# EAGLE board NFluidEX_v1 (EAGLE 9.6.2)
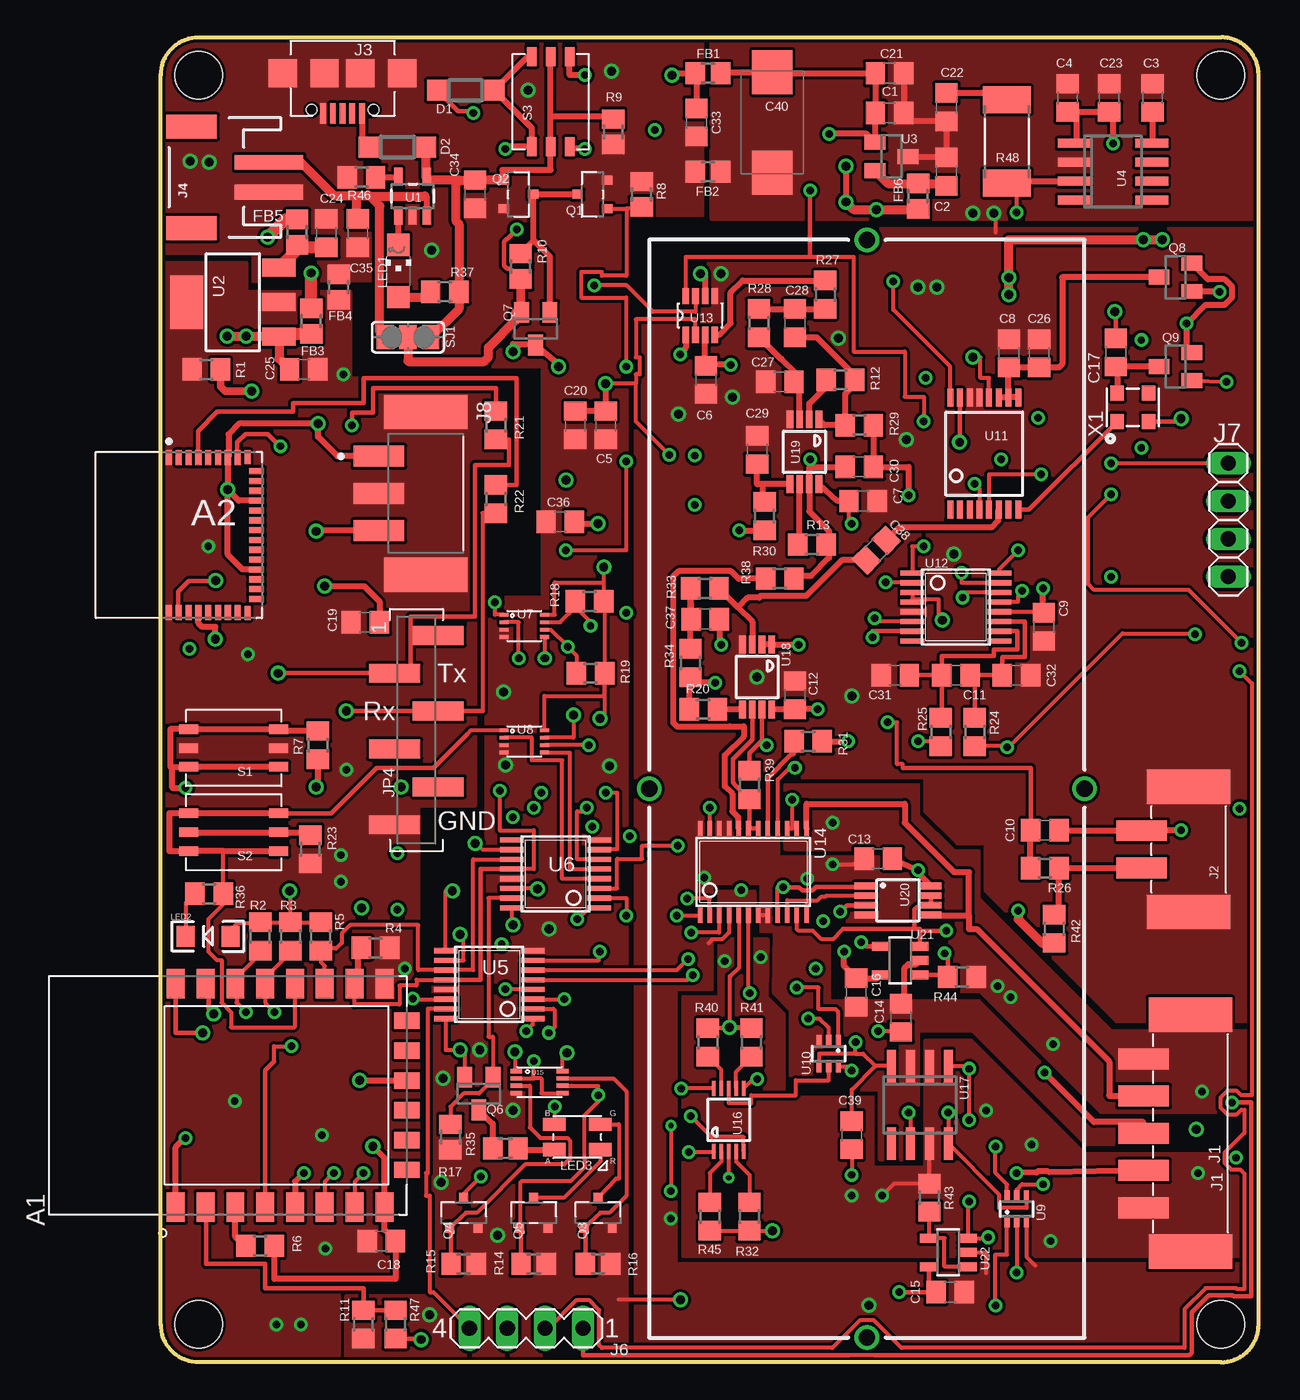
[diagram p2: board, top side]
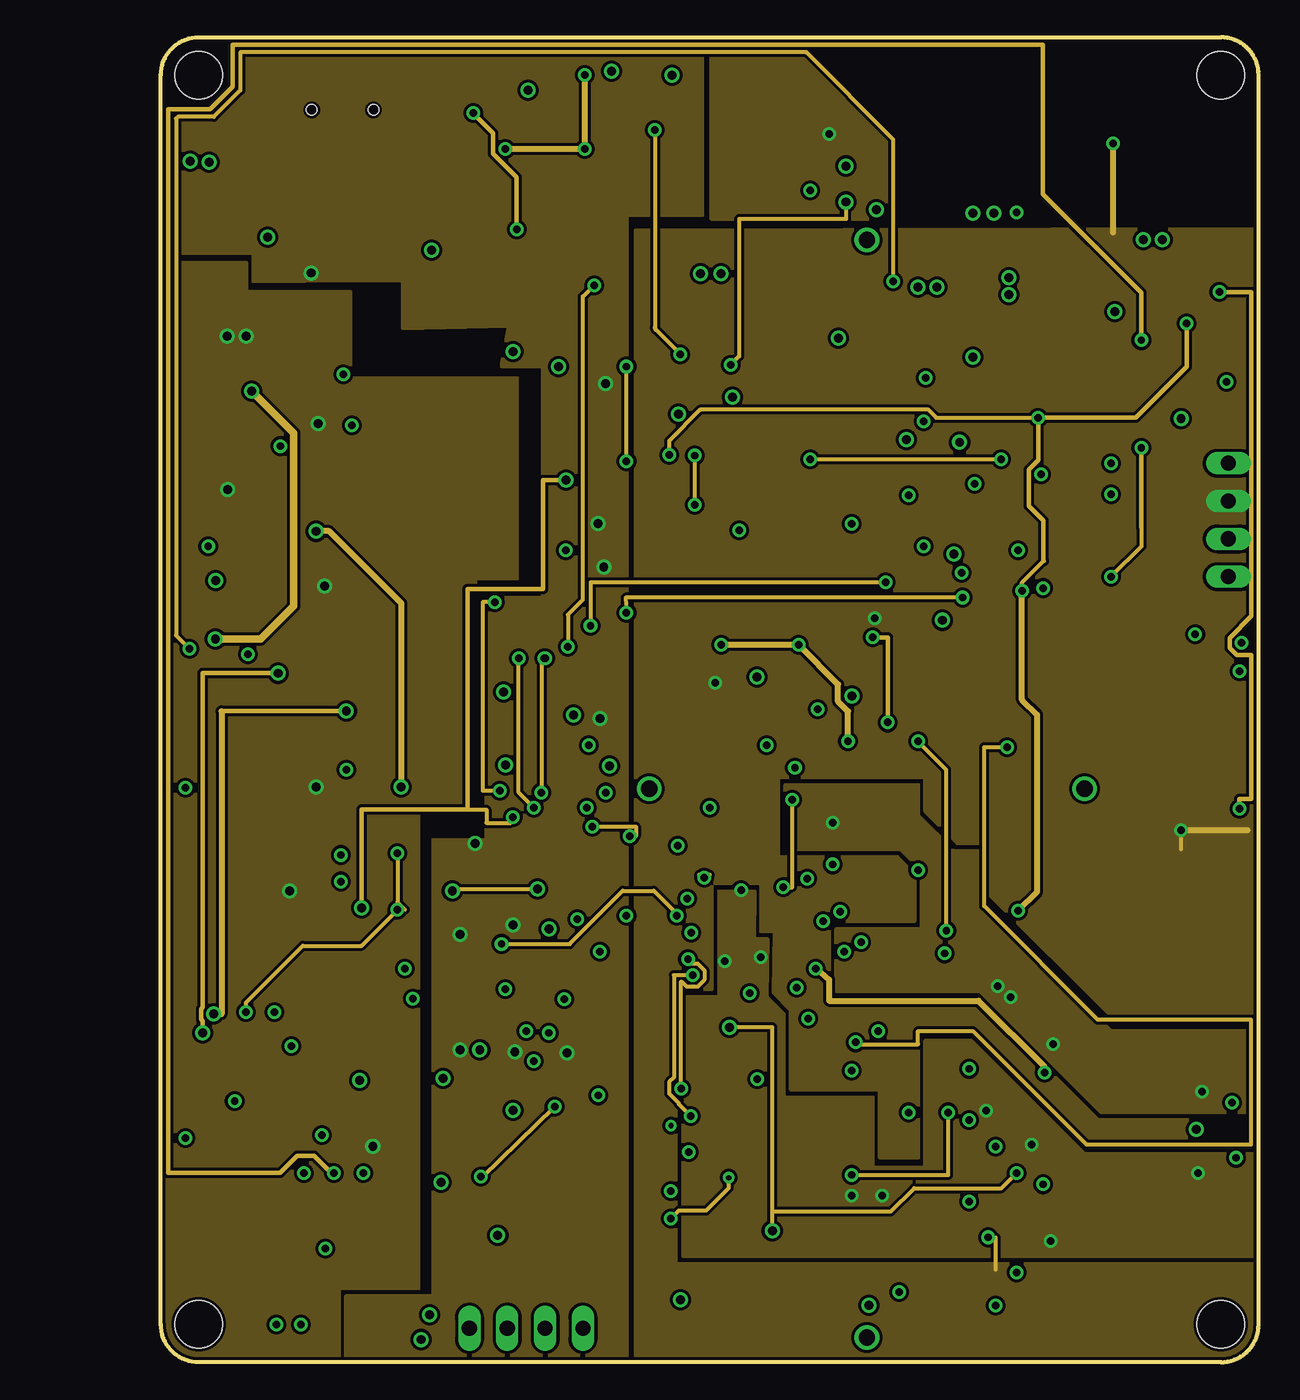
[diagram p3: board, inner layer Route2]
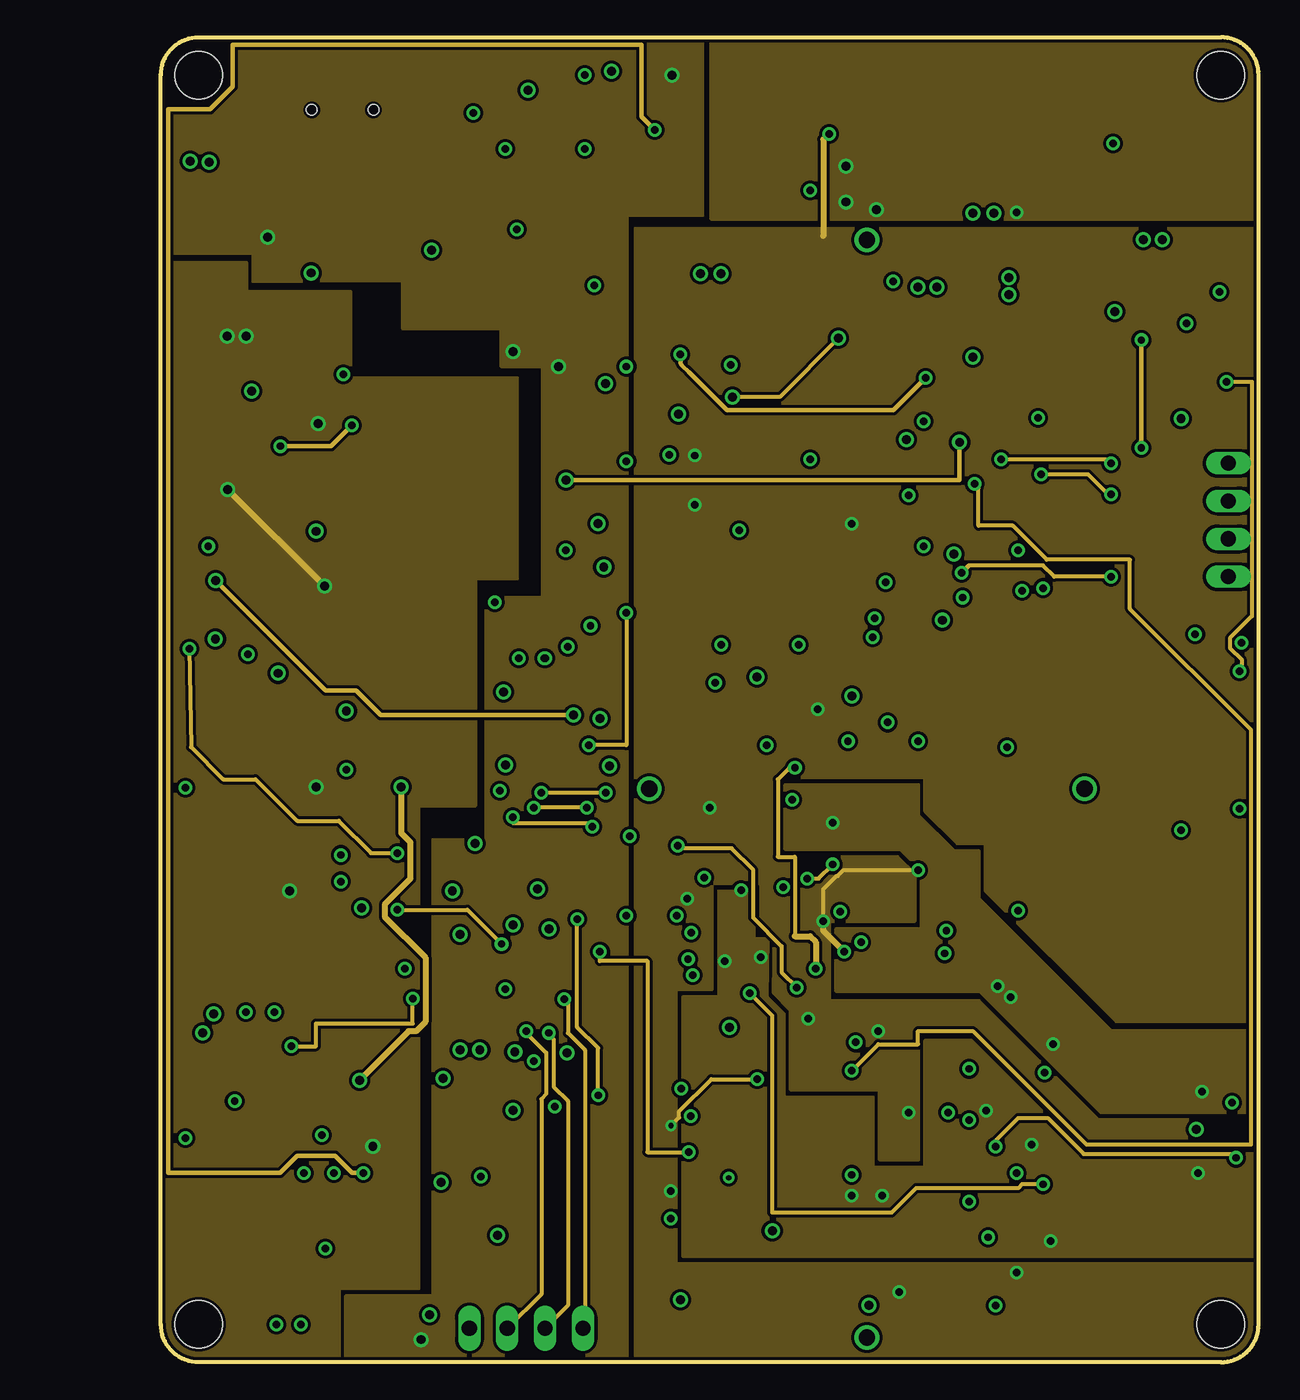
[diagram p4: board, inner layer Route15]
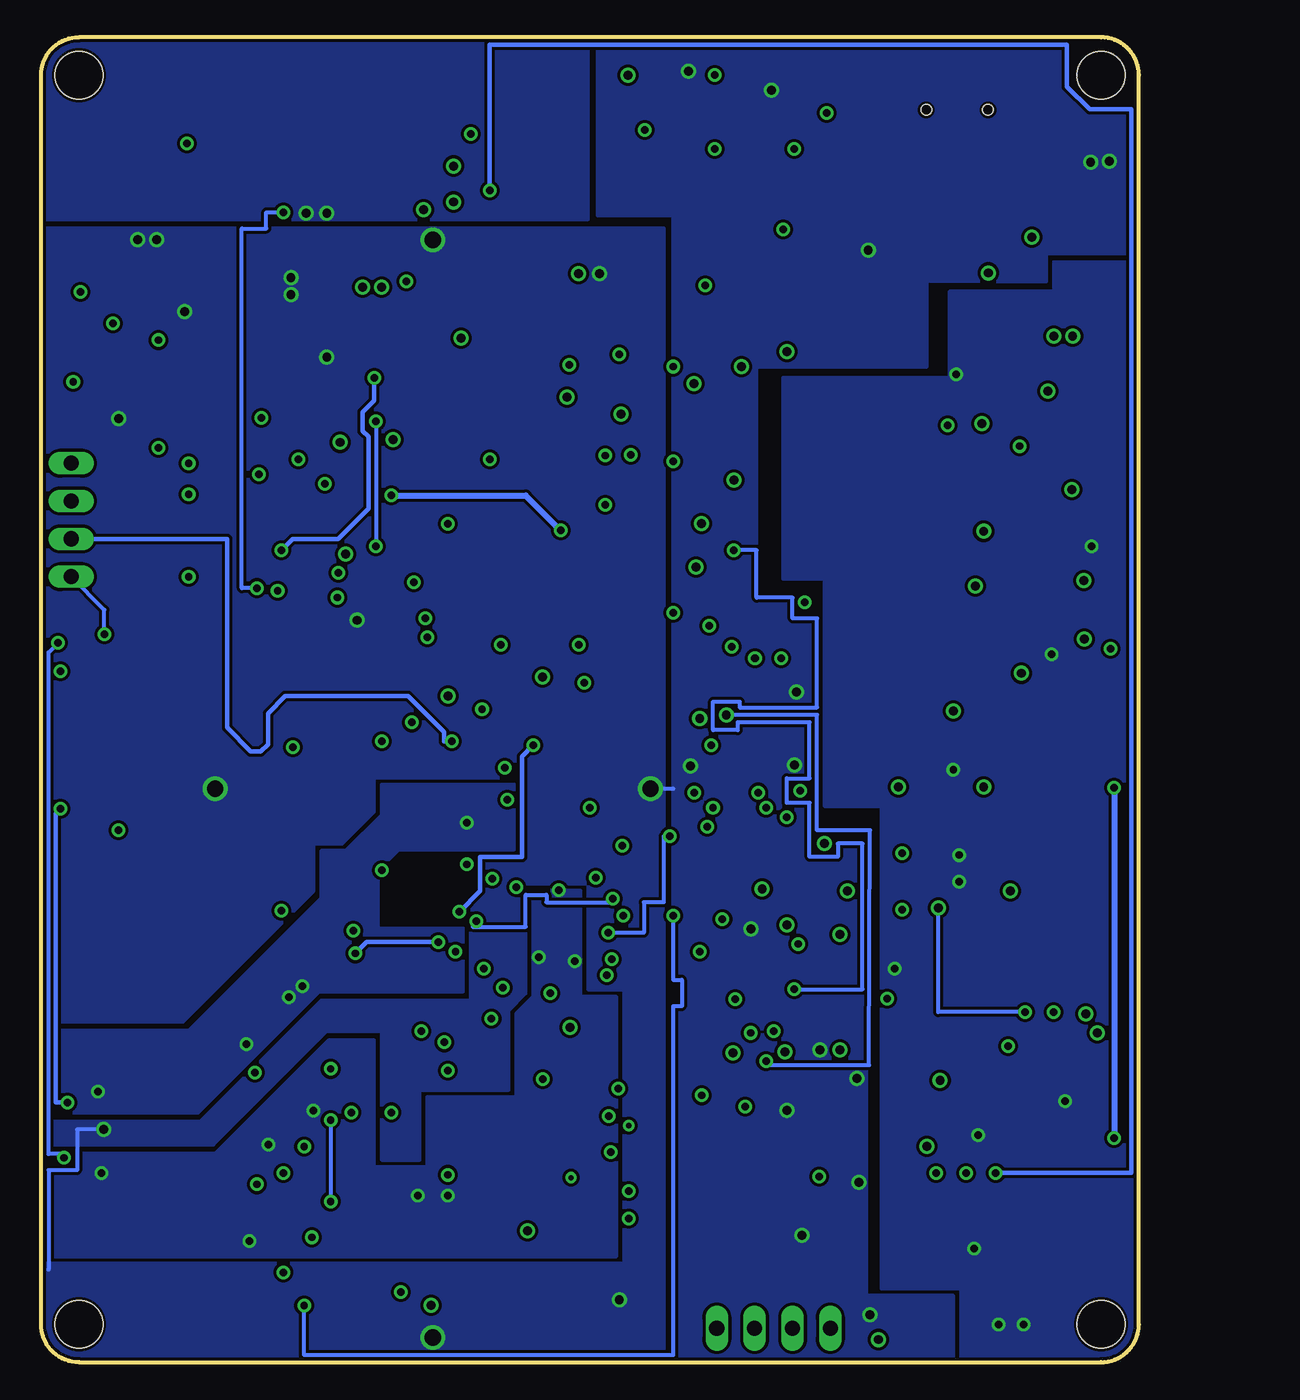
[diagram p5: board, bottom side, seen from below]

Size 73.66 x 88.9 mm. Coordinates in mm from the lower left corner, seen from the top.
Outline: 2.54,0 arc-90 0,2.54 0,86.36 arc-90 2.54,88.9 71.12,88.9 arc-90 73.66,86.36 73.66,2.54 arc-90 71.12,0 2.54,0
Copper layers (1+2*15+16): Top 0.035mm / dielectric 1.5mm / Route2 0.035mm / dielectric 0.15mm / Route15 0.035mm / dielectric 0.2mm / Bottom 0.035mm
Design rules "default *": minimum track width 10mil, minimum drill 12mil, track to track 8mil, track to pad 8mil, pad to pad 8mil, via to via 8mil, smd to smd 8mil, copper to edge 8mil, drill to drill 8mil, minimum pad ring 10mil, minimum via ring 8mil, stop-mask expansion 0mil, vias tented up to drill 0mil, thermal gap 10mil
Net classes: 1 VCC: width 0.381 mm; 2 LEDPower: width 0.203 mm; 3 ButtonSignal: width 0.203 mm
Holes 3.2 mm at 2.54,2.54 71.12,2.54 71.12,86.36 2.54,86.36

## Footprints (pad centres in the part's own frame; a part is rotated, then mirrored left to right if it is on the bottom)
XCVR_ESP8266-12E/ESP-12E = smd 2 x 1.2: 1 -7.5,7; 2 -7.5,5; 3 -7.5,3; 4 -7.5,1; 5 -7.5,-1; 6 -7.5,-3; 7 -7.5,-5; 8 -7.5,-7; 15 7.5,-7; 16 7.5,-5; 17 7.5,-3; 18 7.5,-1; 19 7.5,1; 20 7.5,3; 21 7.5,5; 22 7.5,7 | smd 1.1 x 1.7: 9 -5,-8.5; 10 -3,-8.5; 11 -1,-8.5; 12 1,-8.5; 13 3,-8.5; 14 5,-8.5
CYPRESS_SEMICONDUCTOR_CYBLE-014008-00_0 = smd 0.99 x 0.41: 1 5.205,0.67; 2 5.205,0.01; 3 5.205,-0.65; 4 5.205,-1.31; 5 5.205,-1.97; 6 5.205,-2.63; 7 5.205,-3.29; 8 5.205,-3.95; 25 -5.205,-3.95; 26 -5.205,-3.29; 27 -5.205,-2.63; 28 -5.205,-1.97; 29 -5.205,-1.31; 30 -5.205,-0.65; 31 -5.205,0.01; 32 -5.205,0.67 | smd 0.94 x 0.41: 9 5.23,-4.61; 24 -5.23,-4.61 | smd 0.41 x 0.99: 10 4.29,-5.205; 11 3.63,-5.205; 12 2.97,-5.205; 13 2.31,-5.205; 14 1.65,-5.205; 15 0.99,-5.205; 16 0.33,-5.205; 17 -0.33,-5.205; 18 -0.99,-5.205; 19 -1.65,-5.205; 20 -2.31,-5.205; 21 -2.97,-5.205; 22 -3.63,-5.205; 23 -4.29,-5.205
C0805 = smd 1.3 x 1.5: 1 -0.95,0; 2 0.95,0
D/7343-31W = smd 2.95 x 2.7: + 3.375,0; - -3.375,0
DIODE_SOD123 = smd 1.4 x 1.4: A 1.9,0; C -1.9,0
R0805 = smd 1.3 x 1.5: 1 -0.85,0; 2 0.85,0
5-PIN-VERT_PHOENIX_SMD = smd 1.4 x 3.4: 1 -5,3.15; 2 -2.5,3.15; 3 0,3.15; 4 2.5,3.15; 5 5,3.15 | smd 2.3 x 5.6: ANCHOR@1 -7.95,0; ANCHOR@2 7.95,0
2-PIN-VERT_PHOENIX_SMD = smd 1.4 x 3.4: 1 -1.25,3.15; 2 1.25,3.15 | smd 2.3 x 5.6: ANCHOR@1 -4.2,0; ANCHOR@2 4.2,0
USB_MICRO_B_WURTH_629105136821 = smd 0.4 x 1.35: 1-PWR -1.3,2.7; 2-D- -0.65,2.7; 3-D+ 0,2.7; 4-ID 0.65,2.7; 5-GND 1.3,2.7 | smd 1.9 x 1.9: CASE1 -4,0; CASE2 -1.2,0; CASE3 1.2,0; CASE4 4,0 | hole 0.7: -2.075,2.45; 2.075,2.45
JST-2-SMD = smd 1 x 4.6: 1 -1,-3.7; 2 1,-3.7 | smd 1.6 x 3.4: NC1 -3.4,1.5; NC2 3.4,1.5
TSM-106-XX-XXX-SV = smd 1.27 x 3.429: 1 6.35,-1.46; 2 3.81,1.46; 3 1.27,-1.46; 4 -1.27,1.46; 5 -3.81,-1.46; 6 -6.35,1.46
MA04-1 = drill 1.016 long: 1 -3.81,0; 2 -1.27,0; 3 1.27,0; 4 3.81,0
1X04 = drill 1.016 long: 1 -3.81,0; 2 -1.27,0; 3 1.27,0; 4 3.81,0
PHOENIX_CONTACT_1771101_0 = smd 1.4 x 3.4: 1 -2.5,-3.15; 2 0,-3.15; 3 2.5,-3.15 | smd 2.3 x 5.6: 4 -5.45,0; 5 5.45,0
CHIPLED_1206 = smd 1.5 x 1.5: A 0,-1.75; C 0,1.75
LED-1206 = smd 1.2 x 1.4: A -1.5,0; C 1.5,0
LED_RGB_WURTH_150141M173100 = smd 1.5 x 0.9: A 1.55,0.85; B 1.55,-0.85; G -1.55,-0.85; R -1.55,0.85
NEXPERIA_BSS138P_215_0 = smd 0.7 x 0.6: 1 -1,0.95; 2 -1,-0.95; 3 1,0
SOT-23-3 = smd 1.4 x 1: 1 -1.1,0.95; 2 -1.1,-0.95; 3 1.1,0
R0805' = smd 1.3 x 1.5: 1 -0.95,0; 2 0.95,0
R2512 = smd 1.8 x 3.2: 1 -2.8,0; 2 2.8,0
RAFI-MICON5_SWITCH = smd 1.27 x 0.635: A1 -3.025,1.27; A2 3.025,1.27; A3 -3.025,-1.27; A4 3.025,-1.27; K1 -3.025,0; K2 3.025,0
SMARTDART-SHIELD = drill 1.1: P$1 -36.83,0; P$2 36.83,0; P$3 0,14.605; P$4 0,-14.605
SJ_2 = smd 1.168 x 1.6: 1 -1.524,0; 2 0,0; 3 1.524,0
SOT23-5 = smd 0.55 x 1.2: 1 -0.95,-1.3; 2 0,-1.3; 3 0.95,-1.3; 4 0.95,1.3; 5 -0.95,1.3
SOT-223 = smd 1.219 x 2.235: 1 -2.311,-3.099; 2 0,-3.099; 3 2.311,-3.099 | smd 3.6 x 2.2: 4 0,3.099
SOIC-8 = smd 2.2 x 0.6: 1 -2.6,1.905; 2 -2.6,0.635; 3 -2.6,-0.635; 4 -2.6,-1.905; 5 2.6,-1.905; 6 2.6,-0.635; 7 2.6,0.635; 8 2.6,1.905
TSSOP16 = smd 1.6 x 0.35: 1 -2.918,2.275; 2 -2.918,1.625; 3 -2.918,0.975; 4 -2.918,0.325; 5 -2.918,-0.325; 6 -2.918,-0.975; 7 -2.918,-1.625; 8 -2.918,-2.275; 9 2.918,-2.275; 10 2.918,-1.625; 11 2.918,-0.975; 12 2.918,-0.325; 13 2.918,0.325; 14 2.918,0.975; 15 2.918,1.625; 16 2.918,2.275
VSSOP8 = smd 0.6 x 0.25: 1 -1.35,0.75; 2 -1.35,0.25; 3 -1.35,-0.25; 4 -1.35,-0.75; 5 1.35,-0.75; 6 1.35,-0.25; 7 1.35,0.25; 8 1.35,0.75
SC70-6 = smd 0.35 x 0.8: 1 -0.63,-0.85; 2 0.02,-0.85; 3 0.67,-0.85; 4 0.67,0.85; 5 0.02,0.85; 6 -0.63,0.85
SSOP-16 = smd 1.2 x 0.4: 1 -3.751,2.275; 2 -3.751,1.625; 3 -3.751,0.975; 4 -3.751,0.325; 5 -3.751,-0.325; 6 -3.751,-0.975; 7 -3.751,-1.625; 8 -3.751,-2.275; 9 3.751,-2.275; 10 3.751,-1.625; 11 3.751,-0.975; 12 3.751,-0.325; 13 3.751,0.325; 14 3.751,0.975; 15 3.751,1.625; 16 3.751,2.275
SOT-23-8 = smd 1.1 x 0.45: 1 -1.3,0.975; 2 -1.3,0.325; 3 -1.3,-0.325; 4 -1.3,-0.975; 5 1.3,-0.975; 6 1.3,-0.325; 7 1.3,0.325; 8 1.3,0.975
TSSOP24 = smd 0.991 x 0.305: 1 -2.918,3.575; 2 -2.918,2.925; 3 -2.918,2.275; 4 -2.918,1.625; 5 -2.918,0.975; 6 -2.918,0.325; 7 -2.918,-0.325; 8 -2.918,-0.975; 9 -2.918,-1.625; 10 -2.918,-2.275; 11 -2.918,-2.925; 12 -2.918,-3.575; 13 2.918,-3.575; 14 2.918,-2.925; 15 2.918,-2.275; 16 2.918,-1.625; 17 2.918,-0.975; 18 2.918,-0.325; 19 2.918,0.325; 20 2.918,0.975; 21 2.918,1.625; 22 2.918,2.275; 23 2.918,2.925; 24 2.918,3.575
US-8 = smd 0.8 x 0.3: 1 -1.55,0.75; 2 -1.55,0.25; 3 -1.55,-0.25; 4 -1.55,-0.75; 5 1.55,-0.75; 6 1.55,-0.25; 7 1.55,0.25; 8 1.55,0.75
MSOP10 = smd 1 x 0.25: 1 -2.113,1; 2 -2.113,0.5; 3 -2.113,0; 4 -2.113,-0.5; 5 -2.113,-1; 6 2.113,-1; 7 2.113,-0.5; 8 2.113,0; 9 2.113,0.5; 10 2.113,1
UMAX8 = smd 1.2 x 0.45: 1 -2.175,0.975; 2 -2.175,0.325; 3 -2.175,-0.325; 4 -2.175,-0.975; 5 2.175,-0.975; 6 2.175,-0.325; 7 2.175,0.325; 8 2.175,0.975
MSOP8 = smd 1.45 x 0.45: 1 -2.2,0.975; 2 -2.2,0.325; 3 -2.2,-0.325; 4 -2.2,-0.975; 5 2.2,-0.975; 6 2.2,-0.325; 7 2.2,0.325; 8 2.2,0.975
SOT23-5' = smd 0.6 x 1.2: 1 -0.95,-1.306; 2 0,-1.306; 3 0.95,-1.306; 4 0.95,1.306; 5 -0.95,1.306
DSC60XX_OSCILLATOR_3.2X2.5MM = smd 1 x 0.9: 1 -0.95,1.05; 2 -0.95,-1.05; 3 0.95,-1.05; 4 0.95,1.05

## Placement (x,y rotation side)
A1  ESP8266-12E/ESP-12E  [XCVR_ESP8266-12E/ESP-12E]  8,17.91 90 top
A2  CYPRESS_SEMICONDUCTOR_CYBLE-014008-00CYPRESS_SEMICONDUCTOR_CYBLE-014008-00_0_0  [CYPRESS_SEMICONDUCTOR_CYBLE-014008-00_0]  1.21,55.5 90 top
C1  0.1uF  [C0805]  48.9,83.82 0 top
C2  0.1uF  [C0805]  52.7,79.88 90 top
C3  0.1uF  [C0805]  66.55,84.84 90 top
C4  0.1uF  [C0805]  60.83,84.84 90 top
C5  0.1uF  [C0805]  29.84,62.87 270 top
C6  0.1uF  [C0805]  36.58,65.91 270 top
C7  0.1uF  [C0805]  47.12,57.78 0 top
C8  0.1uF  [C0805]  56.9,67.69 90 top
C9  0.1uF  [C0805]  59.25,49.34 270 top
C10  0.1uF  [C0805]  59.31,35.69 0 top
C11  0.1uF  [C0805]  53.34,46.1 180 top
C12  0.1uF  [C0805]  42.55,44.75 90 top
C13  0.1uF  [C0805]  48.13,33.78 180 top
C14  0.1uF  [C0805]  49.66,23.11 90 top
C15  0.1uF  [C0805]  52.96,4.7 0 top
C16  0.1uF  [C0805]  46.66,24.82 270 top
C17  0.1uF  [C0805]  64.07,67.75 90 top
C18  10u  [C0805]  14.8,8.13 180 top
C19  10u  [C0805]  13.72,49.66 180 top
C20  10u  [C0805]  27.81,62.87 270 top
C21  10u  [C0805]  48.9,86.49 0 top
C22  10u  [C0805]  52.7,84.2 270 top
C23  10u  [C0805]  63.63,84.84 90 top
C24  10u  [C0805]  11.11,75.76 90 top
C25  10u  [C0805]  9.59,66.61 0 top
C26  10u  [C0805]  58.93,67.69 90 top
C27  2.2n 5%  [C0805]  41.53,65.79 180 top
C28  2.2n 5%  [C0805]  42.55,69.72 270 top
C29  2.2n 5%  [C0805]  40.01,61.21 90 top
C30  2.2n 5%  [C0805]  46.86,60.07 180 top
C31  0.01uF  [C0805]  49.28,46.1 180 top
C32  0.01uF  [C0805]  57.4,46.1 0 top
C33  0.01uF  [C0805]  35.94,83.19 270 top
C34  4.7uF  [C0805]  21.08,78.36 270 top
C35  4.7uF  [C0805]  13.21,75.76 270 top
C36  4.7uF  [C0805]  26.8,56.39 180 top
C37  0.22uF_5%  [C0805]  36.53,49.86 0 top
C38  0.22uF_5%  [C0805]  48.01,54.48 45 top
C39  10p  [C0805]  46.35,15.24 90 top
C40  47u  [D/7343-31W]  41.02,83.19 90 top
D1  PMEG6010ER  [DIODE_SOD123]  20.45,85.34 180 top
D2  PMEG6010ER  [DIODE_SOD123]  15.88,81.53 180 top
FB1  [R0805]  36.7,86.49 180 top
FB2  [R0805]  36.7,79.88 180 top
FB3  [R0805]  10.1,69.85 90 top
FB4  [R0805]  11.94,72.14 90 top
FB5  [R0805]  9.14,75.82 270 top
FB6  [R0805]  50.8,78.23 90 top
J1  [5-PIN-VERT_PHOENIX_SMD]  69.09,15.37 90 top
J2  [2-PIN-VERT_PHOENIX_SMD]  68.96,34.42 90 top
J3  USB-MICRO-B  [USB_MICRO_B_WURTH_629105136821]  12.19,86.49 180 top
J4  [JST-2-SMD]  3.56,79.5 90 top
J5  FTDI_961106  [TSM-106-XX-XXX-SV]  17.14,42.42 90 top
J6  [MA04-1]  24.51,2.29 180 top
J7  [1X04]  71.63,56.52 270 top
J8  PHOENIX_CONTACT_1771101PHOENIX_CONTACT_1771101_0_0  [PHOENIX_CONTACT_1771101_0]  17.78,58.29 270 top
LED1  [CHIPLED_1206]  15.94,73.22 0 top
LED2  RED  [LED-1206]  3.17,28.57 180 top
LED3  [LED_RGB_WURTH_150141M173100]  27.94,15.11 180 top
Q1  BSS138  [NEXPERIA_BSS138P_215_0]  28.96,78.36 180 top
Q2  BSS138  [NEXPERIA_BSS138P_215_0]  24,78.36 0 top
Q3  BSS138  [NEXPERIA_BSS138P_215_0]  29.34,10.03 90 top
Q4  BSS138  [NEXPERIA_BSS138P_215_0]  20.32,10.03 90 top
Q5  BSS138  [NEXPERIA_BSS138P_215_0]  25.02,10.03 90 top
Q6  BSS84  [SOT-23-3]  21.34,18.03 270 top
Q7  DMP2160  [SOT-23-3]  25.15,69.34 270 top
Q8  DMP2160  [SOT-23-3]  68.07,72.8 180 top
Q9  DMP2160  [SOT-23-3]  68.07,66.8 180 top
R1  10k  [R0805']  3.05,66.61 0 top
R2  10k  [R0805']  6.67,28.57 270 top
R3  10k  [R0805']  8.7,28.57 270 top
R4  10k  [R0805']  14.41,27.81 0 top
R5  10k  [R0805']  10.73,28.57 90 top
R6  10k  [R0805']  6.67,7.81 0 top
R7  10k  [R0805']  10.54,41.4 90 top
R8  10k  [R0805]  32.26,78.36 270 top
R9  10k  [R0805]  30.35,82.55 90 top
R10  10k  [R0805]  24.13,73.53 270 top
R11  10k  [R0805']  13.59,2.54 270 top
R12  10k  [R0805']  45.59,65.91 0 top
R13  10k  [R0805']  43.69,54.86 180 top
R14  10k  [R0805]  25.02,6.6 180 top
R15  10k  [R0805]  20.32,6.6 180 top
R16  10k  [R0805]  29.34,6.6 180 top
R17  10k  [R0805]  19.43,15.11 90 top
R18  10k  [R0805']  28.77,51.05 180 top
R19  10k  [R0805']  28.83,46.23 180 top
R20  10k  [R0805']  36.4,43.81 0 top
R21  1k  [R0805']  22.48,62.87 270 top
R22  1k  [R0805']  22.48,57.91 270 top
R23  1k  [R0805']  10.03,34.42 270 top
R24  1k  [R0805']  54.61,42.29 270 top
R25  1k  [R0805']  52.32,42.29 270 top
R26  1k  [R0805']  59.31,33.15 0 top
R27  22k 1%  [R0805']  44.58,71.63 90 top
R28  22k 1%  [R0805']  40.13,69.72 90 top
R29  22k 1%  [R0805']  46.86,62.87 180 top
R30  22k 1%  [R0805']  40.51,56.77 270 top
R31  100k_0.1%  [R0805']  43.43,41.66 180 top
R32  100k_0.1%  [R0805']  39.5,9.78 90 top
R33  100k_0.1%  [R0805']  36.5,51.92 180 top
R34  100k_0.1%  [R0805']  35.53,46.91 270 top
R35  3.3k  [R0805]  23.11,14.35 180 top
R36  3.3k  [R0805']  3.24,31.43 180 top
R37  3.3k  [R0805']  19.05,71.82 180 top
R38  10k_0.1%  [R0805']  41.53,52.58 180 top
R39  10k_0.1%  [R0805']  39.5,38.73 90 top
R40  10k_0.1%  [R0805']  36.7,21.46 90 top
R41  1M_0.1%  [R0805']  39.62,21.46 90 top
R42  1M_0.1%  [R0805']  59.94,29.08 270 top
R43  100  [R0805']  51.56,11.05 270 top
R44  100  [R0805']  53.75,25.86 0 top
R45  1k_0.1%  [R0805']  36.83,9.78 90 top
R46  2K  [R0805']  13.46,79.5 180 top
R47  33K  [R0805']  15.75,2.54 90 top
R48  2  [R2512]  56.77,81.92 270 top
S1  RESET  [RAFI-MICON5_SWITCH]  4.89,41.21 180 top
S2  GPIO0_ESP12E  [RAFI-MICON5_SWITCH]  4.89,35.56 180 top
S3  MICON5  [RAFI-MICON5_SWITCH]  26.16,84.58 90 top
SH1  SMARTDART_SHIELD  [SMARTDART-SHIELD]  47.37,38.48 90 top
SJ1  [SJ_2]  16.57,68.77 180 top
U1  MCP73831  [SOT23-5]  16.89,78.23 0 top
U2  AP7365  [SOT-223]  4.83,71.12 90 top
U3  ISL60002BAH33Z  [SOT-23-3]  49.02,80.9 0 top
U4  TLE2426  [SOIC-8]  63.88,79.88 0 top
U5  74HC595  [TSSOP16]  22.03,25.34 180 top
U6  74HC595  [TSSOP16]  26.48,32.77 180 top
U7  74LVC1G53  [VSSOP8]  24.38,49.4 0 top
U8  74LVC1G53  [VSSOP8]  24.38,41.66 0 top
U9  ADG779  [SC70-6]  57.4,10.29 0 top
U10  ADG779  [SC70-6]  44.83,20.7 180 top
U11  AD5933  [SSOP-16]  55.24,60.96 90 top
U12  ADS1220  [TSSOP16]  53.34,50.67 0 top
U13  AD5061BRJZ  [SOT-23-8]  36.2,70.23 90 top
U14  ADG715  [TSSOP24]  39.75,32.89 90 top
U15  74LVC2G86  [US-8]  25.4,18.8 0 top
U16  ADG704  [MSOP10]  38.1,16.26 90 top
U17  LMP7721  [SOIC-8]  50.93,17.27 270 top
U18  LMP7702  [UMAX8]  40.01,45.97 270 top
U19  LMP7702  [UMAX8]  43.18,61.09 270 top
U20  LMP7702  [MSOP8]  49.45,30.99 0 top
U21  LMP7715  [SOT23-5']  49.61,26.95 90 top
U22  LMP7715  [SOT23-5']  52.83,7.37 90 top
X1  DSC6083-250kHz  [DSC60XX_OSCILLATOR_3.2X2.5MM]  65.21,64.07 90 top

## Tracks (layer width: path | path; a pad name or v marks a point on that pad's centre or on a via)
!CS1  (via drill 0.5)
  Top 0.254: U7.7 26.79,49.65 27.82,50.67 R18.2 28.19,50.67 28.19,50.29 28.83,49.66 v28.83,49.4 | U12.2 48.64,52.3 v48.64,52.32
  Route2 0.254: v48.64,52.32 28.83,52.32 v28.83,49.4
!CS2  (via drill 0.5)
  Top 0.254: U13.7 35.87,70.48 33.02,70.48 31.24,72.26 v29.08,72.26 | U7.6 26.16,49.15 v27.3,48.01 27.88,47.43 R19.2
  Route2 0.254: v29.08,72.26 28.32,71.5 28.32,51.18 27.3,50.16 v27.3,48.01
!DRDY  (via drill 0.5)
  Top 0.254: U12.14 53.85,51.65 v53.78,51.31 | v28.7,41.4 U8.6
  Route2 0.254: v53.78,51.31 31.18,51.31 v31.24,50.29
  Route15 0.254: v31.24,50.29 31.24,41.4 v28.7,41.4
!RST  (via drill 0.5)
  Top 0.406: R7.2 8.04,42.35 S1.A3 S1.A4 0.64,42.48 0.64,39.94 0.76,39.94 | 0.76,39.94 S1.A2 S1.A1 | v1.65,15.05 1.6,15.05 1,14.45 A1.1 | 0.76,39.94 0.76,38.54 v1.65,38.54
  Bottom 0.406: v1.65,38.54 v1.65,15.05
AD5933_VIN  (via drill 0.5)
  Top 0.254: U9.6 56.77,11.93 56.01,12.7 v56.01,14.48 | v59.05,59.56 55.57,59.56 U11.5 | v72.52,48.26 68.96,51.82 62.61,51.82 62.23,52.2 62.23,56.71 v63.75,58.23
  Route15 0.254: v56.01,14.48 56.01,14.86 57.53,16.38 59.5,16.38 61.91,13.97 72.14,13.97 v72.14,13.72 | v59.05,59.56 62.23,59.56 63.56,58.23 v63.75,58.23
  Bottom 0.254: v72.14,13.72 72.14,13.97 73.15,13.97 73.15,47.62 v72.52,48.26
ADC
  Top 0.305: R47.2 R11.1 13.59,4.95 6.99,4.95 6.99,6.6 3.05,6.6 3.05,10.36 A1.2
AGND  (via drill 0.35, 0.5, 0.6)
  Top 0.254: v55.88,77.09 56.01,76.96 56.01,75.82 | U22.2 55.37,7.37 55.37,5.97 | v45.09,33.4 46.42,33.4 C13.2 | 58.67,6.48 58.07,7.08 U9.3 | 36.77,28.13 37.01,28.37 37.66,28.37 38.13,28.83 U14.4 | U16.3 v38.1,12.38 | U14.8 U14.7
  Top 0.406: FB2.1 37.63,79.81 | C21.2 C1.2 50.41,83.25 C22.2 C2.2 52.64,80.9 U3.3 | C14.2 49.91,24.31 49.91,26.47 50.14,26.71 50.67,26.71 U21.2
  Route2 0.254: 36.83,32.7 36.13,32.7 v36.45,32.51 | v38.1,12.38 38.1,11.68 36.58,10.16 34.73,10.16 v34.23,9.65
  Route15 0.254: v43.37,32.45 44.13,32.45 v45.09,33.4 | v45.47,68.71 41.53,64.77 v38.35,64.77
  other vias: 54.48,77.09 47.5,3.81 53.21,54.23 34.73,63.63 37.59,73.03 50.8,72.14 52.07,72.14 50.04,61.91 40.01,45.97 46.35,44.7
  pour Bottom (no thermals): 36.96,88.9 73.66,88.9 73.66,76.71 36.96,76.71
  pour Top (no thermals): 36.96,88.9 73.66,88.9 73.66,76.71 36.96,76.71
  pour Top (no thermals): 31.88,76.07 73.66,76.07 73.66,22.86 64.14,22.86 55.37,31.62 55.37,34.8 53.47,34.8 51.31,36.96 51.31,39.24 41.4,39.24 41.4,33.91 49.4,33.91 50.55,32.77 50.55,29.59 44.83,29.59 44.83,24.26 54.86,24.26 62.87,16.26 73.66,16.26 73.66,14.61 62.1,14.61 54.48,22.23 50.8,22.23 50.8,13.59 48.26,13.59 48.26,18.29 42.29,18.29 42.29,23.62 41.15,24.77 41.2,28.91 40.28,28.91 40.28,32.13 36.96,32.13 36.96,25.02 34.54,25.02 34.54,6.6 73.66,6.6 73.66,0 31.88,0
AIN0/REFP1
  Top 0.305: C11.1 54.61,46.1 | 54.61,46.1 C32.1 56.45,47.31 57.96,47.31 57.96,49.7 U12.11 | R24.1 54.61,46.1
AIN1
  Top 0.305: C11.2 C31.1 | U12.10 57.45,49.05 57.45,47.82 55.88,47.82 55.88,47.37 52.39,47.37 C11.2 | R25.1 52.39,43.24 C11.2
AIN2  (via drill 0.5)
  Top 0.254: 49.78,39.88 49.78,40.13 49.4,40.13 49.4,42.93 v48.77,42.93
  Top 0.305: C10.1 58.36,39.88 49.78,39.88 | v47.75,48.64 47.75,49.05 U12.7
  Top 0.406: R26.1 58.3,33.09 C10.1
  Route2 0.305: v48.77,42.93 48.77,48.64 v47.75,48.64
AREF  (via drill 0.5)
  Top 0.254: U12.6 48.09,49.7 v47.88,49.91 | v55.5,8.38 55.5,8.32 U22.3 54.14,10.79 v54.23,10.79 | U17.1 54.23,19.87 v54.23,19.68 v54.23,16.26
  Top 0.406: 61.47,83.89 C23.1 63.88,83.89 v63.88,81.79 | 61.47,83.89 C4.1 | U4.1 61.47,81.97 61.47,83.89 | C10.2 60.28,35.67 J2.2 | 68.45,35.67 J2.2 | v68.45,35.69 65.81,35.69 J2.2 | 35.45,45.59 R20.1 | 35.45,45.59 35.45,45.88 R34.2 | v37.21,45.59 35.45,45.59
  Route2 0.254: 68.45,34.42 v68.45,35.69 | v55.5,8.38 56.01,8.38 56.01,6.22
  Route2 0.406: v63.88,81.79 63.88,75.82 | 72.9,35.69 v68.45,35.69
  Bottom 0.254: v54.23,16.26 v54.23,10.79
  pour Route2 (no thermals): 31.88,75.95 73.66,76.07 73.66,22.86 64.14,22.86 55.37,31.62 55.37,34.8 53.47,34.8 51.31,36.96 51.31,39.24 41.4,39.24 41.4,33.91 49.4,33.91 50.55,32.77 50.55,29.59 44.83,29.59 44.83,24.26 54.86,24.26 62.87,16.26 73.66,16.26 73.66,14.61 62.1,14.61 54.48,22.23 50.8,22.23 50.8,13.72 48.26,13.72 48.26,18.29 42.29,18.29 42.29,23.62 41.15,24.77 41.2,28.91 40.28,28.91 40.28,32.13 36.96,32.13 36.96,25.02 34.54,25.02 34.54,6.6 73.66,6.6 73.66,0 31.88,-0.13
AVDD  (via drill 0.5, 0.6)
  Top 0.254: C9.1 59.24,50.35 U12.12 | R48.2 57.4,79.11 v57.4,77.15
  Top 0.406: R48.2 56.9,79.25 U4.3 | v45.97,80.26 v45.97,77.85 | v38.23,66.93 36.58,66.93 C6.1 36.52,66.86 U13.3 | 59.24,50.35 59.18,50.35 v59.18,51.94
  Top 0.61: v45.97,77.85 46.48,77.34 v48.01,77.34 50.76,77.34 FB6.1
  Route2 0.254: v45.97,77.85 45.97,76.71 38.8,76.71 38.8,67.5 v38.23,66.93
  Bottom 0.254: v59.18,51.94 60.2,51.94 60.2,76.07 58.55,76.07 58.55,77.15 v57.4,77.15
  pour Route15 (no thermals): 36.96,88.9 73.66,88.9 73.66,76.71 36.96,76.71
BT_CONNECTED  (via drill 0.5, 0.6)
  Top 0.254: v27.69,43.43 27.69,41.91 U8.7 | U15.2 25.02,19.05 | U15.5 25.53,18.05 25.53,19.05 25.02,19.05 | 25.02,19.05 v25.02,20.19
  Top 0.305: A2.31 1.17,50.32 1.17,51.7 1.88,52.41 3.64,52.41 v3.68,52.45
  Route15 0.305: v27.69,43.43 14.75,43.43 13.1,45.09 11.05,45.09 v3.68,52.45
  Bottom 0.254: v25.02,20.19 25.02,19.94 18.1,19.94 18.03,35.69 21.59,35.69 21.59,43.43 v27.69,43.43
C  (via drill 0.5)
  Top 0.254: U14.16 41.4,35.84 41.4,39.12 42.16,39.88 v42.55,39.88
  Top 0.406: v59.31,19.43 62.61,16.13 65.91,16.13 65.91,15.39 J1.3
  Route2 0.406: v43.94,26.42 44.83,25.65 44.83,24.26 54.86,24.26 59.31,19.81 v59.31,19.43
  Route15 0.254: v42.55,39.88 42.16,39.88 41.4,39.12 41.4,33.91 42.55,33.91 42.55,28.57
  Route15 0.406: 42.55,28.57 43.56,28.57 43.94,28.19 v43.94,26.42
DACOUT  (via drill 0.5)
  Top 0.254: 44.83,54.92 R13.1 | 43.51,60.02 43.56,60.07 | v43.56,60.58 43.51,60.52 | v63.75,60.33 J7.1
  Top 0.406: 43.56,60.07 C30.2 | 43.51,60.52 43.51,60.02 U19.7 43.51,57.08 44.83,55.75 44.83,54.92 44.83,53.98 43.62,52.77 42.67,52.77 R38.1
  Route2 0.254: v56.39,60.58 v43.56,60.58
  Route15 0.254: v63.75,60.33 63.37,60.58 v56.39,60.58
DDS  (via drill 0.5)
  Top 0.406: C37.2 37.48,48.25 v37.59,48.13 | v42.8,48.13 41,48.13 U18.1 U18.2 | R31.1 v46.1,41.66
  Route2 0.406: v37.59,48.13 v42.8,48.13 45.45,45.49 45.45,44.33 46.1,43.67 v46.1,41.66
  Bottom 0.305: J7.3 61.19,55.24 61.19,42.58 59.58,40.97 58.91,40.97 58.44,41.45 58.44,43.54 57.28,44.7 49.02,44.7 46.61,42.29 46.61,41.66 v46.1,41.66
DGND  (via drill 0.5)
  other vias: 12.26,66.29 3.17,54.74 10.79,15.24 4.95,17.53 11.05,7.62 5.84,47.5 12.45,39.75 12.06,34.04 12.06,32.26 7.75,2.54 9.4,2.54 16.38,26.42
  pour Top (no thermals): 0,73.79 5.71,73.79 5.71,71.82 12.7,71.82 12.7,66.04 23.88,66.04 23.88,52.58 21.08,52.58 21.08,37.34 17.27,37.34 17.27,4.95 11.94,4.95 11.94,0 0,0
  pour Bottom (no thermals): 0,73.79 5.71,73.79 5.71,71.82 12.7,71.82 12.7,66.04 23.88,66.04 23.88,52.58 21.08,52.58 21.08,37.34 17.27,37.34 17.27,4.95 11.94,4.95 11.94,0 0,0
DVDD  (via drill 0.6)
  Top 0.254: LED2.A 4.67,29 5.14,29.46 6.61,29.46 R2.1 R3.1 | R3.1 R5.2 | R3.1 8.7,31.56 v8.64,31.62
  Top 0.406: 14.87,49.66 C19.1 14.67,51.05 13.65,52.07 v10.97,52.07 | R6.2 7.62,5.59 15.74,5.59 C18.1 15,8.87 A1.8 15,13.7 v14.22,14.48 | v10.41,38.61 10.54,38.61 R7.1 | J8.1 11.85,60.79 10.54,62.1 v10.54,62.99 5.54,62.99 5.29,63 4.54,62.26 4.54,60.75 A2.7 v4.5,58.55 | A2.13 5.23,57.81 v4.5,58.55 | A2.20 5.49,53.19 4.5,54.18 v4.5,58.55
  Top 0.61: U2.1 7.92,67.33 C25.1 | v4.45,68.83 v5.71,68.83 7.76,68.83 7.92,69
  Top 0.813: U2.1 7.92,69 FB3.1
  Route15 0.406: v4.5,58.55 v10.97,52.07
  pour Route2 (no thermals): 0,73.79 5.71,73.79 5.71,71.82 12.7,71.82 12.7,66.04 23.88,66.04 23.88,52.58 21.08,52.58 21.08,37.34 17.27,37.34 17.27,4.95 11.94,4.95 11.94,0 0,0
  pour Route15 (no thermals): 0,73.79 5.71,73.79 5.71,71.88 12.7,71.82 12.7,66.04 23.88,66.04 23.88,52.58 21.08,52.58 21.08,37.34 17.27,37.34 17.27,4.95 11.94,4.95 11.94,0 0,0
GND  (via drill 0.6)
  Top 0.254: U11.12 55.57,66.04 54.99,66.04 54.99,67.44 v54.48,67.44 | v52.45,49.78 52.2,49.78 52.2,51.18 50.42,51.18 U12.4 U12.3 | v34.86,4.19 30.73,4.19
  Top 0.305: X1.2 68.27,63.12 v68.45,63.31 | C17.2 64.07,70.42 v64.01,70.48
  Top 0.406: v36.2,73.03 36.52,73.03 U13.6
  Top 0.61: v56.9,71.63 v56.9,72.77 56.9,75.31 v65.91,75.31 v67.18,75.31
  Bottom 0.254: v69.47,15.62 71.25,15.62 71.25,12.89 73.15,12.89 73.15,6.22 | SH1.P$3 31.24,38.48
  other vias: 24.64,85.34 3.24,80.52 1.97,80.58 30.23,86.61 22.99,44.96 18.92,19.05 21.4,20.95 18.8,12.06 23.62,16.89 30.1,40.01 18.03,3.17 23.11,40.07 26.04,29.08 22.61,8.51 18.16,74.61
  pour Top (no thermals): 0,88.9 36.32,88.9 36.32,76.96 31.24,76.96 31.24,0 12.45,0 12.45,4.45 18.29,4.45 18.29,35.05 21.84,35.05 21.84,51.31 25.65,51.31 25.65,66.8 14.22,66.8 14.22,72.58 13.21,72.58 6.22,72.52 6.22,74.42 0,74.42
  pour Bottom (no thermals): 0,88.9 36.32,88.9 36.32,76.96 31.24,76.96 31.24,0 12.45,0 12.45,4.45 18.29,4.45 18.29,35.05 21.84,35.05 21.84,51.31 25.65,51.31 25.65,66.8 14.22,66.8 14.22,72.58 13.21,72.58 6.22,72.52 6.22,74.42 0,74.42
  pour Bottom (no thermals): 31.88,76.07 73.66,76.07 73.66,22.86 64.14,22.86 55.37,31.62 55.37,34.8 53.47,34.8 51.31,36.96 51.31,39.24 41.4,39.24 41.4,33.91 49.4,33.91 50.55,32.77 50.55,29.59 44.83,29.59 44.83,24.26 54.86,24.26 62.99,16.13 73.66,16.13 73.66,14.61 62.1,14.61 54.48,22.23 50.8,22.23 50.8,13.59 48.26,13.59 48.26,18.29 42.29,18.29 42.29,23.62 41.15,24.77 41.15,32.13 36.96,32.13 36.96,25.02 34.54,25.02 34.54,6.6 73.66,6.6 73.66,0 31.88,0
GPIO00
  Top 0.254: 20.57,42.16 20.82,42.41 U8.1 | 4.19,34.29 R36.1 4.19,30.73 3.17,29.72 3.17,27.56 3.75,26.99 4.06,26.99 4.06,24.13 4.7,23.5 4.7,22.48 8.96,22.48 8.96,25.37 A1.18
  Top 0.305: S2.A3 11.43,36.83 14.48,39.88 18.29,39.88 20.57,42.16
  Top 0.406: S2.A3 S2.A4 0.57,36.83 0.57,34.29 S2.A2 4.19,34.29 S2.A1
GPIO02
  Top 0.254: U6.11 20.95,33.74 20.95,26.31 U5.11 17.27,26.31 17.27,29.34 12.7,29.34 12.13,28.77 12.13,28.13 11.75,27.75 10.86,27.75 R5.1 10.73,26.86 11,26.59 A1.17
GPIO10  (via drill 0.6)
  Top 0.406: J8.3 10.45,55.79 v10.41,55.75 | v13.34,18.92 16.48,18.92 A1.12
  Route2 0.406: v10.41,55.75 11.3,55.75 16.13,50.93 v16.13,38.61
  Route15 0.406: v16.13,38.61 16.13,35.51 16.73,34.9 16.73,32.43 15.02,30.71 15.02,29.89 17.75,27.15 17.75,22.84 17.11,22.2 16.61,22.2 v13.34,18.92
GPIO16  (via drill 0.5)
  Top 0.254: 7.6,20.17 7.6,21.21 v8.76,21.21 | v16.89,24.38 16.76,24.36 U5.14
  Top 0.305: A1.4 7,19.58 7.6,20.17
  Route15 0.254: v8.76,21.21 10.4,21.21 10.4,22.73 16.89,22.73 v16.89,24.38
GUARD_REF  (via drill 0.5)
  other vias: 45.09,36.2 56.13,25.25 59.88,21.34 69.85,18.16 57.02,24.49
  pour Top (no thermals): 41.91,38.73 50.8,38.73 50.8,36.7 53.21,34.29 54.86,34.29 54.86,31.11 63.75,22.23 73.66,22.23 73.66,16.76 63.12,16.76 54.99,24.89 45.34,24.89 45.34,29.08 51.05,29.08 51.05,33.02 49.66,34.42 41.91,34.42
  pour Bottom (no thermals): 41.91,38.73 50.8,38.73 50.8,36.7 53.21,34.29 54.86,34.29 54.86,31.11 63.75,22.23 73.66,22.23 73.66,16.76 63.12,16.76 54.99,24.89 45.34,24.89 45.34,29.08 51.05,29.08 51.05,33.02 49.66,34.42 41.91,34.42
  pour Route2 (no thermals): 41.91,38.73 50.8,38.73 50.8,36.7 53.21,34.29 54.86,34.29 54.86,31.11 63.75,22.23 73.66,22.23 73.66,16.76 63.12,16.76 54.99,24.89 45.34,24.89 45.34,29.08 51.05,29.08 51.05,33.02 49.66,34.42 41.91,34.42
  pour Route15 (no thermals): 41.91,38.73 50.8,38.73 50.8,36.7 53.21,34.29 54.86,34.29 54.86,31.11 63.75,22.23 73.66,22.23 73.66,16.76 63.12,16.76 54.99,24.89 45.34,24.89 45.34,29.08 51.05,29.08 51.05,33.02 49.66,34.42 41.91,34.42
GUARD_W  (via drill 0.5)
  Top 0.254: U17.7 R43.1 49.21,12 v48.39,11.18
  other vias: 59.69,8.13 69.6,12.7 58.42,14.61 55.37,16.89 46.35,11.18 40.26,27.18 37.85,26.92 38.93,31.69
  pour Top (no thermals): 73.66,13.97 73.66,7.11 35.05,7.11 35.05,24.51 37.47,24.51 37.47,31.62 39.83,31.6 39.78,28.4 40.69,28.4 40.64,24.51 41.78,23.37 41.78,17.78 47.75,17.78 47.75,13.08 51.31,13.08 51.31,21.59 54.36,21.59 61.98,13.97
  pour Bottom (no thermals): 37.47,31.62 40.64,31.62 40.64,24.51 41.78,23.37 41.78,17.78 47.75,17.78 47.75,13.08 51.31,13.08 51.31,21.59 54.36,21.59 61.98,13.97 73.66,13.97 73.66,7.11 35.05,7.11 35.05,24.51 37.47,24.51
  pour Route2 (no thermals): 37.47,31.62 39.83,31.6 39.8,28.4 40.69,28.4 40.64,24.51 41.78,23.37 41.78,17.78 47.75,17.78 47.75,13.08 51.31,13.08 51.31,21.59 54.36,21.59 61.98,13.97 73.66,13.97 73.66,7.11 35.05,7.11 35.05,24.51 37.47,24.51
  pour Route15 (no thermals): 37.47,31.62 39.83,31.6 39.78,28.4 40.69,28.4 40.64,24.51 41.78,23.37 41.78,17.78 47.75,17.78 47.75,13.08 51.31,13.08 51.31,21.59 54.36,21.59 61.98,13.97 73.66,13.97 73.66,7.11 35.05,7.11 35.05,24.51 37.47,24.51
MISO  (via drill 0.5)
  Top 0.254: v53.72,52.96 53.72,52.3 U12.15 | v11.6,12.7 11,12.11 A1.6
  Route2 0.254: 65.79,56.01 65.79,54.74 v63.75,52.7
  Route2 0.305: v11.6,12.7 11.43,12.7 10.29,13.84 9.14,13.84 8,12.7 0.51,12.7 0.51,84.07 3.3,84.07 4.83,85.6 4.83,88.39 59.18,88.39 59.18,78.36 65.79,71.75 v65.79,68.58 | v65.79,61.34 65.79,56.01
  Route15 0.254: v63.75,52.7 59.94,52.7 59.18,53.47 54.23,53.47
  Route15 0.305: v65.79,68.58 v65.79,61.34 | 54.23,53.47 v53.72,52.96
MOSI  (via drill 0.5)
  Top 0.254: U12.16 56.26,53.21 v57.53,54.48 | 35.22,68.09 arc-45 35.15,67.91 | v13.6,12.7 13,12.11 A1.7
  Top 0.406: U13.1 35.22,68.09 | 35.15,67.91 v34.86,67.63
  Route2 0.254: v33.15,82.68 33.15,69.45 arc45 33.22,69.27 v34.86,67.63
  Route15 0.254: v34.86,67.63 34.86,67.1 arc45 34.94,66.92 35.43,66.42
  Route15 0.305: v13.6,12.7 12.83,12.7 11.68,13.84 9.14,13.84 8,12.7 0.51,12.7 0.51,84.07 3.3,84.07 4.83,85.6 4.83,88.39 32.26,88.39 32.26,83.57 v33.15,82.68 | 35.43,66.42 37.97,63.88 49.15,63.88 v51.31,66.04
  Bottom 0.305: v51.31,66.04 51.31,64.52 52.07,63.75 52.07,62.48 51.69,62.1 51.69,57.28 53.72,55.24 56.77,55.24 v57.53,54.48
N$1  (via drill 0.5)
  Top 0.305: R21.1 22.48,65.35 14.24,65.35 14.24,63.71 12.83,63.71 v12.83,62.87 | A2.8 5.13,60.73 5.13,61.73 5.68,62.28 7.17,62.28 7.98,61.47 v8.01,61.47
  Route15 0.305: v8.01,61.47 11.43,61.47 v12.83,62.87
N$2
  Top 0.254: 43.33,30.99 U14.12 | 43.33,30.99 44.07,30.99 44.32,31.24 44.58,31.24 44.65,31.31 U20.2 | U14.10 42.03,30.99 43.33,30.99
N$3
  Top 0.406: J3.1-PWR 13.49,81.53 D2.A
N$4
  Top 0.305: R22.1 23.88,58.86 23.88,66.04 13.59,66.04 13.59,64.34 8.89,64.34 8.89,63.78 3.78,63.78 2.49,62.49 2.49,60.73 A2.4
N$5
  Top 0.254: U15.7 30.36,19.05 31.24,18.16 31.24,11.18 30.1,10.03 29.49,10.03 Q3.1
  Top 0.305: Q3.1 28.49,8.83 R16.2
N$6  (via drill 0.5)
  Top 0.254: U9.5 57.42,11.58 57.78,11.94 v59.18,11.94 | v39.5,24.77 39.43,24.84 U14.6
  Route15 0.254: v59.18,11.94 57.78,11.94 57.53,11.68 50.67,11.68 49.02,10.03 41.02,10.03 41.02,23.24 v39.5,24.77
N$7
  Top 0.406: R46.1 15.94,79.5 U1.5
N$8  (via drill 0.6)
  Top 0.254: U5.9 19.12,31.62 v19.56,31.62 | v25.27,31.75 25.27,31.79 U6.14
  Route2 0.254: v19.56,31.62 19.68,31.75 v25.27,31.75
N$9
  Top 0.254: 42.85,65.54 C27.1 42.61,66.36 | 41.66,67.31 41.59,67.31
  Top 0.406: U19.3 42.85,65.54 | 42.61,66.36 41.66,67.31 | 41.59,67.31 R28.1
N$10
  Top 0.406: LED1.C 15.94,75.79 U1.1
N$11
  Top 0.254: U13.4 37.44,68.93
  Top 0.406: 37.44,68.93 38.23,69.72 38.23,71.75 39.05,72.58 R27.2
N$12
  Top 0.61: LED1.A 17.75,71.47 R37.2
N$13
  Top 0.406: R48.1 arc90 56.33,85.15 C22.1
N$14
  Top 0.305: U14.17 40.73,39.2 42.29,40.77 42.42,40.77 42.48,40.83 R31.2
N$15
  Top 0.254: R27.1 | C28.1 R28.2
  Top 0.406: R28.2 R27.1
N$16
  Top 0.406: S2.K2 S2.K1 10.03,35.56 R23.1
N$17
  Top 0.254: U15.3 24.77,18.55 24.77,15.75 25.47,15.04 27.28,15.04 27.47,14.85 27.47,13.68 27.07,13.27 24.45,13.27 21.21,10.03 20.47,10.03 Q4.1
  Top 0.305: Q4.1 19.47,8.83 R15.2
N$18  (via drill 0.5)
  Top 0.406: v23.11,81.41 23.11,81.56 S3.A1 24.89,82.8 D1.C 24.61,87.61 S3.A2 | v28.45,86.36 27.43,86.36 S3.A4 | v28.45,81.41 27.43,81.41 S3.A3
  Route2 0.406: v23.11,81.41 v28.45,81.41 v28.45,86.36
N$19
  Top 0.406: U4.8 66.55,81.86 C3.1
N$20
  Top 0.254: 46.54,65.59 R12.2 46.54,66.23
  Top 0.406: U19.1 44.55,62.87 R29.2 45.91,64.96 46.54,65.59 | C28.2 44,68.77 46.54,66.23
N$21  (via drill 0.5)
  Top 0.254: C30.1 47.81,59.91 | R30.2
  Top 0.406: R29.1 C30.1 50.16,60.07 v50.16,58.17 | v38.8,55.82 R30.2
  Bottom 0.406: v50.16,58.17 41.15,58.17 v38.8,55.82
N$22
  Top 0.254: 40.39,57.72 R30.1
  Top 0.406: U19.5 40.39,58.91 | 40.39,58.91 40.01,58.91 C29.1 | 40.39,57.72 40.39,58.91
N$23
  Top 0.406: U19.2 43.51,64.33 44.64,65.47 R12.1
N$24  (via drill 0.5)
  Top 0.254: U14.14 U14.15 42.37,35.81 v42.37,37.74 | U14.9 41.38,31.52 | 41.38,31.52 | 41.38,31.52 41.38,31.86 v41.76,31.86
  Top 0.305: v41.76,31.86 42.81,31.86 43.03,31.64 43.71,31.64 43.96,31.89 47.18,31.89 U20.1
  Route2 0.254: v41.76,31.86 42.37,31.86 v42.37,37.74 42.37,37.77
N$25
  Top 0.254: R13.2 42.85,54.86
  Top 0.406: 42.85,54.86 U19.6
N$26
  Top 0.254: R36.2 1.68,30.82 LED2.C
N$27
  Top 0.61: U3.2 48.79,79.08 FB6.2 52.56,79.08 C2.1
N$28  (via drill 0.5)
  Top 0.254: U9.4 58.07,10.35 56.26,10.35 56.26,11.24 U17.8 v52.83,16.76 | C39.1 v46.35,12.57
  Route2 0.254: v46.35,12.57 52.83,12.57 v52.83,16.76
N$29
  Top 0.254: 39.5,35.81 U14.19
  Top 0.305: U14.19 U14.18 | 39.5,35.81 R39.1 38.6,38.68 38.39,38.89 38.39,40.48 39.68,41.77 U18.6
N$30  (via drill 0.5)
  Top 0.305: 40.33,41.7 U18.7 | R39.2 39.5,40.87 40.33,41.7 | U20.3 46.03,30.66 v45.59,30.23 | v40.64,41.4 40.34,41.7 40.33,41.7
  Bottom 0.305: v45.59,30.23 44.2,31.62 44.2,33.91 41.4,33.91 41.4,40.64 v40.64,41.4
N$31  (via drill 0.5)
  Top 0.254: U10.6 46.06,19.85 v46.35,19.56 | v54.61,58.93 54.92,58.62 U11.4
  Route15 0.254: v46.35,19.56 48.13,21.34 50.8,21.34 50.8,22.23 54.48,22.23 62.1,14.61 73.15,14.61 73.15,42.42 65.02,50.55 65.02,53.85 59.44,53.85 57.15,56.13 54.86,56.13 54.86,58.67 v54.61,58.93
N$32
  Top 0.254: U16.7 38.6,19.49 R41.1
N$33  (via drill 0.5)
  Top 0.305: U21.4 47.28,27.9 v46.99,28.19 | v52.58,27.43 52.8,27.21 52.8,26.04 | 52.8,26.04 R44.1 | U21.1 52.76,26 52.8,26.04
  Bottom 0.305: v46.99,28.19 51.82,28.19 v52.58,27.43
N$34
  Top 0.254: U16.9 37.6,19.62 R40.1
N$35
  Top 0.254: R10.1 24.13,74.56
  Top 0.406: Q1.3 Q2.3 25.02,78.34 25.02,75.27 | R10.1 25.02,75.27 | Q7.1 26.1,74.19 25.02,75.27
N$36
  Top 0.254: 44.83,19.85 U10.5 44.81,18.92 42.61,18.92 42.61,17.91 39.62,17.91 39.62,17.4 38.1,17.4 U16.8
N$37
  Top 0.254: U16.2 37.6,13.47 36.83,12.7 R45.2
N$38
  Top 0.254: U16.4 38.6,13.47 39.5,12.57 R32.2
N$39
  Top 0.254: LED3.G 30.73,15.96 30.73,12.32 30.52,12.32 Q3.3
N$40
  Top 0.254: R43.2 51.56,8.91 U22.4 52.58,8.32 52.58,6.42 U22.1
N$41  (via drill 0.5)
  Top 0.254: Q4.3 20.32,11.3 v21.46,12.45 | v26.42,17.14 26.42,15.99 LED3.B
  Route2 0.254: v21.46,12.45 21.59,12.45 v26.42,17.14
N$42
  Top 0.254: LED3.R 29.49,13.49 27.04,11.03 Q5.3
N$43
  Top 0.406: Q6.3 22.26,16.01 R35.2
N$44
  Top 0.406: R35.1 24.05,14.26 LED3.A
N$45
  Top 0.406: R38.2 38.76,52.58 38.27,53.07 34.73,53.07 34.38,52.72 34.38,42.91 34.63,42.66 38.17,42.66 38.18,42.67 39.12,42.67 39.12,42 37.83,40.71 37.83,38.66 38.34,38.15 38.34,36.97 38.58,36.73 38.73,36.58 38.73,35.85 U14.20
N$46
  Top 0.813: U2.3 9.14,74.65 FB5.2 9.31,74.81 C24.1
N$47
  Top 0.406: R6.1 5.6,7.81 5,8.4 A1.3
N$48
  Top 0.305: X1.1 58.25,57.21 U11.8
N$49  (via drill 0.5)
  Top 0.305: D1.A 19.94,83.95 20.95,83.95 v20.95,83.82 | R10.2 23.44,73.38 23.23,73.38 23.02,73.59 23.02,75.18 23.23,75.39 23.25,75.39 v23.88,76.01
  Top 0.61: R10.2 24.13,70.44 Q7.2 23.81,70.44 23.81,69.91 21.98,68.08 21.98,67.44 21.69,67.14 16.61,67.14 16.57,67.18 SJ1.2
  Route2 0.305: v20.95,83.82 22.3,82.47 22.3,81.07 23.88,79.5 v23.88,76.01
N$50
  Top 0.305: 37.36,43.8 R20.2
  Top 0.406: U18.5 37.36,43.8
N$51
  Top 0.406: 35.58,50.04 R33.2 35.53,50 35.58,50 C37.1 35.53,49.82 R34.1
N$52
  Top 0.406: 39.66,48.17 U18.3 39.68,49.69 38.72,50.65 | 38.72,50.65 R33.1 | C38.1 45.69,53.81 43.3,51.42 40.25,51.42 40.13,51.31 39.37,51.31 38.72,50.65
N$53
  Top 0.406: U11.6 56.18,57.17 56.18,56.44 55.74,56.01 49.53,56.01 C38.2
O00  (via drill 0.5)
  Top 0.254: U7.5 v25.73,47.24 v25.78,47.24 | v29.84,38.23 30.61,38.23 30.61,34.42 29.4,34.42 U6.7
  Route2 0.254: v25.73,47.24 25.53,47.24 v25.53,38.23
  Route15 0.254: v25.53,38.23 v29.84,38.23
O01  (via drill 0.5)
  Top 0.254: U6.6 27.94,33.74 27.94,36.96 28.57,36.96 v28.57,37.21 | v24,47.24 24,49.65 U7.2
  Route2 0.254: v25.02,37.21 24,38.23 v24,47.24
  Route15 0.254: v28.57,37.21 v25.02,37.21
O02
  Top 0.254: U6.5 27.43,33.09 27.43,40.91 U8.5
O03
  Top 0.254: U6.4 26.92,32.44 26.92,40.39 24.89,40.39 24.89,41.91 U8.2
O04  (via drill 0.5)
  Top 0.254: U6.3 30.61,31.79 30.61,33.78 32.29,33.78 32.29,34.67 v34.67,34.67 | U10.1 45.46,23.5 45.28,23.69 44.13,23.69 44.13,25.15 v42.67,25.15
  Route15 0.254: v34.67,34.67 34.67,34.48 38.29,34.48 39.75,33.02 39.75,29.82 41.66,27.91 41.66,26.16 v42.67,25.15
O05  (via drill 0.5)
  Top 0.254: U6.2 31.24,31.14 v31.24,29.97 | v56.01,3.81 56.01,7.24 56.77,7.24 U9.1
  Bottom 0.254: v31.24,29.97 31.24,25.65 30.67,25.65 30.67,23.88 31.24,23.88 31.24,0.48 56.01,0.48 v56.01,3.81
O06  (via drill 0.5)
  Top 0.254: Q5.1 24.13,8.99 24.13,12.06 24.23,12.16 27.52,12.16 28.47,13.12 28.47,13.61 28.41,13.68 28.41,16.55 29.34,17.48 v29.34,17.91 29.34,18.54 27.55,18.54 27.55,18.55 U15.6 | v27.94,29.72 28.71,30.49 U6.1
  Top 0.305: Q5.1 24.17,8.83 R14.2
  Route15 0.254: v29.34,17.91 29.34,21.08 27.94,22.48 v27.94,29.72
O07
  Top 0.254: Q6.1 22.29,18.98 21.34,18.03 20.32,18.03 19.43,17.14 R17.2 | U6.15 21.97,31.14 21.97,21.84 22.29,21.84 Q6.1 | 22.35,19.2 Q6.1
O08  (via drill 0.5)
  Top 0.254: U5.7 29.38,26.96 29.38,27.56 v29.46,27.56 | U16.1 37.1,14.1 v35.43,14.1
  Route15 0.254: v29.46,27.56 29.46,26.92 32.64,26.92 32.64,14.1 v35.43,14.1
O09  (via drill 0.5)
  Top 0.254: U16.10 34.94,18.37 v34.92,18.35 | 24.98,26.29 U5.6 34.63,26.31 v35.37,27.05
  Route2 0.254: v35.37,27.05 35.67,26.75 36.01,26.75 36.47,26.3 36.47,25.65 36.01,25.19 35.3,25.19 34.97,25.51 34.87,25.51 34.87,18.4 v34.92,18.35
O10  (via drill 0.5)
  Top 0.254: U16.5 39.1,15.11 36.96,15.11 v35.56,16.51 | U5.5 35.38,25.66 v35.69,25.97
  Route2 0.254: v35.56,16.51 34.73,17.34 34.73,17.4 34.1,18.03 34.1,18.8 34.42,19.11 34.42,25.97 v35.69,25.97
O11  (via drill 0.5)
  Top 0.254: 32.16,77.41 31.24,77.41 | 31.24,77.41 31.24,72.9 29.59,72.9 29.59,73.15 28.19,73.15 28.19,71.44 31.24,71.44 v31.24,66.8 | U5.4 v23.11,25.01 v23.11,25.02 | v27.18,54.48 31.24,54.48 v31.24,60.45 | Q1.1 31.24,77.41
  Top 0.305: R8.2 32.16,77.41
  Route2 0.254: v31.24,60.45 v31.24,66.8
  Bottom 0.254: v23.11,25.02 18.54,25.02 18.54,34.8 20.19,34.8 20.19,33.91 22.1,33.91 22.1,37.53 23.62,37.53 23.62,39.18 22.1,39.18 22.1,42.93 26.92,42.93 26.92,42.42 28.57,42.42 28.57,44.32 26.8,44.32 26.8,43.94 21.59,43.94 21.59,49.91 23.24,49.91 23.24,51.31 25.65,51.31 25.65,54.48 v27.18,54.48
O12  (via drill 0.5)
  Top 0.254: U5.3 v27.07,24.36 | 47.87,0.48 46.18,0.48
  Top 0.305: v71.88,17.42 73.18,17.42 73.18,4.42 72.01,4.42 71.93,4.5 70.31,4.5 69.16,3.35 69.16,0.64 69.01,0.48 47.87,0.48 | 46.18,0.48 28.32,0.48 J6.1
  Top 0.406: v71.02,71.81 70.98,71.85 Q8.1
  Route2 0.305: v71.02,71.81 73.18,71.81 73.18,50.06 71.71,48.59 71.71,47.92 72.18,47.45 73.17,47.45 73.18,47.45 73.18,37.8 72.37,37.8 v72.37,37.15
  Route15 0.254: v27.07,24.36 27.3,24.36 27.3,22.1 28.45,20.95 28.45,2.41 J6.1
  Bottom 0.305: v72.37,37.15 72.37,37.13 72.67,36.83 72.67,17.42 71.98,17.42 71.98,17.45 71.88,17.45 v71.88,17.42
O13  (via drill 0.5)
  Top 0.254: U5.2 26.33,23.71 26.42,23.62 26.42,22.48 v26.04,22.1 | Q9.1 v71.5,65.79 | v72.37,46.35 72.39,46.35 73.2,45.54 73.2,17.91 72.51,17.91 72.21,18.21 71.56,18.21 71.1,17.75 71.1,17.1 71.56,16.64 72.21,16.64 72.51,16.94 72.69,16.94 72.69,15.38 71.35,14.04 71.35,13.39 71.81,12.93 72.41,12.93 72.69,12.65 72.69,4.9 72.21,4.9 72.13,4.98 70.11,4.98 68.68,3.55 68.68,0.96 49.69,0.96 47.85,2.81 46.89,2.81 45.05,0.96 29.59,0.96 29.41,1.14 29.41,3.5 28.77,4.14 27.87,4.14 26.01,2.29 J6.2
  Route15 0.254: v26.04,22.1 26.04,21.97 26.35,21.65 26.35,18.48 27.3,17.53 27.3,3.81 J6.2 | v71.5,65.79 73.2,65.79 73.2,50.05 71.73,48.58 71.73,47.94 72.52,47.15 72.52,46.35 v72.37,46.35
O14  (via drill 0.5)
  Top 0.254: U5.1 24.95,22.67 v24.51,22.23
  Route15 0.254: v24.51,22.23 24.51,22.1 25.84,20.77 25.84,18.03 25.53,17.65 25.53,4.57 J6.3
O15
  Top 0.254: U5.15 17.91,23.71 17.91,12.7 17.78,12.7 17.78,11.18 18.03,11.18 18.03,4.7 18.29,4.7 J6.4
PIO4  (via drill 0.6)
  Top 0.406: v3.66,48.52 3.66,49.34 2.78,49.34 2.52,49.61 A2.29
  Top 0.508: R1.2 4,65.47 4.32,65.15 v6.09,65.15
  Route2 0.508: v6.09,65.15 8.92,62.33 8.92,50.73 6.71,48.52 v3.66,48.52
R
  Top 0.305: U20.5 51.7,29.97
  Top 0.406: U14.13 43.33,37.47 49.91,37.47 49.91,36.2 53.21,32.89 54.23,32.89 54.23,29.97 | 54.23,29.97 54.23,29.07 54.74,29.07 63.63,20.18 63.63,17.91 63.67,17.87 J1.4 | 51.7,29.97 54.23,29.97
RCK/!CS  (via drill 0.5)
  Top 0.254: U5.12 17.14,25.66 17.14,25.27 16,25.27 16,24 13,24 A1.16 | U7.1 22.42,50.15 v22.42,50.99 | v22.73,38.35 22.73,35.69 25.02,35.69 25.02,33.09 U6.12
  Top 0.305: U5.12 21.46,25.65 21.46,33.09 U6.12
  Top 0.406: R4.1 13.21,27.56 13.21,25.62 A1.16
  Route2 0.254: v22.42,50.99 21.59,50.99 21.59,38.35 v22.73,38.35
RXD_ESP12  (via drill 0.6)
  Top 0.254: 21.59,56.96 21.59,43.69
  Top 0.305: R22.2 21.59,56.96 | 21.59,43.69 J5.3 v12.45,43.69 | v3.56,23.37 3.21,23.71 3.21,25.19 A1.21
  Route2 0.305: v12.45,43.69 4.06,43.69
  Route2 0.406: 4.06,43.69 4.06,23.37 v3.56,23.37
SCK  (via drill 0.5)
  Top 0.254: v51.18,63.12 51.18,64.77 49.91,64.77 49.91,67.82 46.48,67.82 46.48,74.17 43.69,74.17 35.22,74.17 U13.8 | v51.18,54.74 50.42,54.74 U12.1
  Top 0.305: v43.56,78.61 43.56,74.3 43.69,74.17
  Top 0.406: v9.6,12.7 9,12.11 A1.5
  Bottom 0.254: v51.18,63.12 v51.18,54.74
  Bottom 0.305: v9.6,12.7 0.51,12.7 0.51,84.07 3.3,84.07 4.83,85.6 4.83,88.39 43.56,88.39 v43.56,78.61
SCL  (via drill 0.5)
  Top 0.254: 5.08,25.41 5.08,25.81 6.67,27.39 R2.2 | 5.08,25.41 5.08,24.13 v5.71,23.5 | v34.61,29.97 U14.1 | U11.16 52.97,66.79 49.15,70.61 v49.15,72.52 | A1.20 5.08,25.41
  Route2 0.254: v5.71,23.5 5.71,24.13 9.53,27.94 13.46,27.94 v15.88,30.35 15.88,30.86 | v22.86,28.07 27.43,28.07 30.99,31.62 33.08,31.62 34.61,30.1 v34.61,29.97 | v49.15,72.52 49.15,82.04 43.31,87.88 5.33,87.88 5.33,85.34 3.56,83.57 1.14,83.57 1.02,83.44 1.02,48.77 v1.91,47.88 | v15.88,34.16 15.88,30.86 | 15.88,30.86 16.38,30.35
  Route15 0.254: v15.88,30.35 20.57,30.35 v22.86,28.07 | v1.91,47.88 2.03,41.27 4.19,39.12 6.35,39.12 9.14,36.32 11.94,36.32 14.1,34.16 v15.88,34.16
SDA  (via drill 0.5, 0.6)
  Top 0.254: U14.3 37.48,28.83 v35.59,28.83 | v7.62,23.5 7,24.11 A1.19 7.05,25.41 7.05,25.84 8.7,27.5 R3.2
  Top 0.305: v53.59,61.72 53.62,61.72 U11.15
  Route2 0.254: 20.57,37.08 21.84,37.08 21.84,36.2 23.5,36.2 v23.62,36.58 | v28.96,35.94 31.88,35.94 31.88,35.31 v31.46,35.31
  Route2 0.305: v13.46,30.48 13.46,37.08 20.57,37.08 20.57,51.88 25.65,51.88 25.65,59.18 v27.18,59.18
  Route15 0.254: v23.62,36.58 23.62,36.2 28.96,36.2 v28.96,35.94
  Route15 0.305: v27.18,59.18 53.59,59.18 v53.59,61.72
  Bottom 0.254: v7.62,23.5 13.46,23.5 v13.46,30.48 | v31.46,35.31 31.88,35.31 31.88,30.86 33.21,30.86 33.21,28.83 v35.59,28.83
TC+
  Top 0.406: R42.1 60.26,30.35 R26.2 60.28,33.17 J2.1
TXD_ESP12  (via drill 0.6)
  Top 0.305: R21.2 23.37,61.91 23.37,60.2 21.08,60.2 21.08,50.04 16.76,50.04 16.76,46.23 J5.2 v7.87,46.23 | A1.22 1,22.1 v2.79,22.1
  Route2 0.305: v7.87,46.23 2.79,46.23 2.79,23.82 2.7,23.72 2.7,23.01 2.79,22.91 v2.79,22.1
V+  (via drill 0.6)
  Top 0.305: v17.46,1.52 17.4,1.59 R47.1
  Top 0.406: v34.29,86.36 34.42,86.49 FB1.2 35.94,86.4 C33.1 | 24.05,68.24 v23.62,67.82 23.62,68.33 25.15,68.33 | Q7.3 26.67,66.97 v26.67,66.8
  Top 0.813: v7.18,75.5 8.34,76.67 FB5.1
  pour Route15 (no thermals): 0,88.9 36.32,88.9 36.32,76.96 31.24,76.96 31.24,0 12.45,0 12.45,4.45 18.29,4.45 18.29,35.05 21.84,35.05 21.84,51.31 25.65,51.31 25.65,66.8 22.86,66.8 22.86,69.34 16.26,69.34 16.26,72.58 13.21,72.58 6.22,72.52 6.22,74.42 0,74.42
VBATT
  Top 0.406: 17.84,77.34 U1.3 17.84,78.11 arc90 17.72,78.23
  Top 0.61: J4.2 9.39,80.5 11.65,78.24 13.14,78.24 | SJ1.3 14.68,69.14 14.68,77.6 14.03,78.24 | 17.72,78.23 17.7,78.24 14.03,78.24 | 14.03,78.24 13.14,78.24 | C35.1 arc-90 13.14,76.77 13.14,78.24
VCC  (via drill 0.35, 0.5)
  Top 0.254: v46.35,56.26 46.17,56.26 C7.1 | U14.23 v36.83,37.21 | U14.2 36.83,31.11 v35.31,31.11 | v50.16,16.76 50.29,16.76 U17.6 | v48.13,22.23 49.59,22.23 C14.1 | v34.23,15.88 v34.23,11.49 | U9.2 57.42,6.05 v57.4,6.03 | U10.2 44.81,22.44 44.2,23.05 v43.43,23.05 | U16.6 39.72,18.99 v40.01,18.99
  Top 0.305: v49.53,4.7 C15.1 51.53,4.7 U22.5
  Top 0.406: FB1.1 37.63,86.56 C40.+ 41.09,86.49 C21.1 C1.1 47.92,83.8 U3.1 47.35,82.42 v44.83,82.42 | C7.1 45.41,57.78 U19.8 | C13.1 50.48,33.15 v50.8,33.02 50.8,32.82 U20.8 | v45.85,27.56 45.85,26.58 C16.1 48.07,25.77 U21.5 | v44.07,43.81 42.55,43.81 C12.1 U18.8
  Route2 0.254: v35.81,60.83 v35.81,57.53
  Route15 0.254: v34.23,15.88 34.78,16.43 34.78,16.83 36.93,18.99 v40.01,18.99 | v44.45,29.59 44.45,31.75 45.32,32.62 45.41,32.62 45.81,33.02 v50.8,33.02
  Route15 0.406: v44.83,82.42 44.45,82.04 44.45,75.56 | v45.85,27.56 44.45,28.96 v44.45,29.59
  Bottom 0.254: 44.7,29.21 41.15,29.21 41.15,31.37 39.75,31.37 39.75,30.86 35.31,30.86 v35.31,31.11
  pour Route15 (no thermals): 31.88,76.07 73.66,76.07 73.66,22.86 64.14,22.86 55.37,31.62 55.37,34.8 53.47,34.8 51.31,36.96 51.31,39.24 41.4,39.24 41.4,33.91 49.4,33.91 50.55,32.77 50.55,29.59 44.83,29.59 44.83,24.26 54.86,24.26 62.87,16.26 73.66,16.26 73.66,14.61 62.1,14.61 54.48,22.23 50.8,22.23 50.8,13.59 48.26,13.59 48.26,18.29 42.29,18.29 42.29,23.62 41.15,24.77 41.2,28.91 40.28,28.91 40.28,32.13 36.96,32.13 36.96,25.02 34.54,25.02 34.54,6.6 73.66,6.6 73.66,0 31.88,0
  pour Route2 (no thermals): 36.96,88.9 73.66,88.9 73.66,76.71 36.96,76.71
VDD  (via drill 0.5, 0.6)
  Top 0.254: U8.8 25.73,44.7 29.78,44.7 R19.1 | R19.1 29.78,50.55 R18.1 29.71,52.32 | U7.8 26.42,50.15 26.42,52.32 29.71,52.32 | U5.16 19.12,20.95 v20.07,20.95 20.39,20.95 Q6.2 | U5.10 20.32,26.96 20.32,28.45 v20.07,28.7 | v21.08,34.8 21.62,34.39 U6.10 | v23.62,29.34 23.56,29.4 U6.16 | v23.75,20.83 23.75,19.55 U15.1 | U15.8 26.95,20.47 v27.24,20.77 | R19.1 29.78,43.18 v29.46,43.18 | U13.2 35.87,69.98 31.88,69.98 31.88,67.44 32.13,67.44 32.13,66.29 31.88,66.29 31.88,65.66 | 31.88,65.66 v29.84,65.66 | v29.72,53.34 29.71,52.83 29.71,52.32 | v34.1,60.9 31.88,63.12 31.88,65.66 | U12.13 56.26,51.05 57.53,51.05 57.53,51.51 v57.78,51.77
  Top 0.305: U12.13 56.31,51 | Q9.2 68.83,67.75
  Top 0.406: C36.1 27.75,56.26 v29.34,56.26 | v29.84,65.66 C5.1 C20.1 | 68.83,67.75 v68.83,69.7 70.08,70.95 71.37,70.95 71.88,71.45 71.88,72.16 71.37,72.67 70.25,72.67 Q8.2
  Top 0.61: v57.53,30.3 57.53,29.72 59.12,28.13 R42.2
  Top 0.813: FB3.2 v10.1,73.09
  Route2 0.254: v58.86,63.37 52.03,63.37 51.51,63.9 36.19,63.9 34.1,61.81 v34.1,60.9 | 59.23,53.75 57.78,52.31 v57.78,51.77 57.78,51.71
  Route2 0.305: 59.23,53.75 59.23,56.47 58.25,57.45 58.25,59.9 58.86,60.52 v58.86,63.37 65.41,63.37 68.83,66.8 v68.83,69.7
  Route2 0.406: v57.53,30.3 58.8,31.57 58.8,43.43 57.78,44.45 v57.78,51.77
  pour Route2 (no thermals): 0,88.9 36.32,88.9 36.32,76.96 31.24,76.96 31.24,0 12.45,0 12.45,4.45 18.29,4.45 18.29,35.05 21.84,35.05 21.84,51.31 25.65,51.31 25.65,66.8 22.86,66.8 23.37,69.53 16.26,69.34 16.26,72.58 13.21,72.58 6.22,72.52 6.22,74.42 0,74.42
VMCLK
  Top 0.406: Q9.3 C17.1 64.17,66.71 X1.4
VNA
  Top 0.406: Q8.3 60.48,72.8 60.48,66.95 60.26,66.74 C26.1 C8.1 56.87,66.72 56.87,64.77 | 56.87,64.77 U11.10 | U11.11 56.28,64.77 56.87,64.77 | U11.9 57.46,64.77 56.87,64.77
VREF  (via drill 0.5)
  Top 0.254: R25.2 52.32,41.66 v50.8,41.66 | U14.11 42.68,29.07 42.79,28.96 43.75,28.96 44.32,28.38 45.09,28.38 45.77,29.07
  Top 0.305: 50.55,29.07 50.91,29.07 | 50.55,29.07 45.77,29.07 | 50.91,29.07 50.93,29.08 50.93,27.91 U21.3 | v52.7,28.96 51.02,28.96 50.91,29.07 | U20.7 U20.6 51.58,30.59 50.78,30.59 50.57,30.39 50.57,29.09 50.55,29.07
  Route2 0.254: v52.7,28.96 52.7,39.75 v50.8,41.66
VTIA  (via drill 0.5)
  Top 0.254: U17.4 47.95,19.87 | 46.61,20.7 44.16,20.7 U10.4 | C39.2 46.35,18.28 47.95,19.87 | 46.61,20.7 v46.61,21.46 | v56.77,41.27 56.77,41.34 | 56.77,41.34 R24.2 | 46.61,20.7 47.12,20.7 47.95,19.87 | 56.77,41.34 56.96,41.34 64.52,48.9 69.34,48.9 v69.41,48.83
  Route2 0.254: v56.77,41.27 55.24,41.27 55.24,30.61 62.87,22.99 73.15,22.99 73.15,14.61 62.1,14.61 54.48,22.23 50.8,22.23 50.8,21.34 46.74,21.34 v46.61,21.46
  Bottom 0.254: v69.41,48.83 69.41,50.48 J7.4
VUSB
  Top 0.254: 22.92,79.31 Q2.1 | 23,80.01 22.92,80.01
  Top 0.406: 17.77,79.53 U1.4 17.84,79.31 | 26.16,83.57 S3.K1 26.16,80.01 22.92,80.01 22.92,79.31 | 26.16,83.57 S3.K2 | R9.2 30.1,83.57 26.16,83.57
  Top 0.61: D2.C 17.77,79.53 | Q2.1 C34.1 20.07,79.31 | 20.07,79.31 18.06,79.31 U1.4 | 20.07,79.31 19.82,79.07 19.82,76.55 20,76.37 R37.1 20,70.67 SJ1.1
W  (via drill 0.5, 0.6)
  Top 0.254: R45.1 R32.1 v41.02,8.83 | R40.2 R41.2 39.62,22.48 v38.16,22.48 38.16,25.84 arc-90 38.23,25.91 38.78,26.46 U14.5 | v57.4,12.7 57.42,12.68 57.61,12.87
  Top 0.406: J1.2 59.59,12.74 59.54,12.8 58.83,12.8 58.76,12.73 v57.4,12.7
  Route2 0.254: v57.4,12.7 57.4,12.68 56.41,11.68 50.55,11.68 48.96,10.1 41.02,10.1 | v41.02,8.83 41.02,10.1 | 41.02,10.1 41.02,22.48 v38.16,22.48

## Text on the board
tNames: Tx | Rx | JP4 | GND | J1
tDocu: + | - | BATTERY | USB | AD5061 / Vout | AREF | DDS | VTIA / Vout | TC- (red) | TC+ | RG | R | C | W | WG | O15 | O14 | O13 | O12
bDocu: ABE-Stat 1.01.03 / Daniel M. Jenkins / May 10, 2018 / AD5933 powered only from Vdd